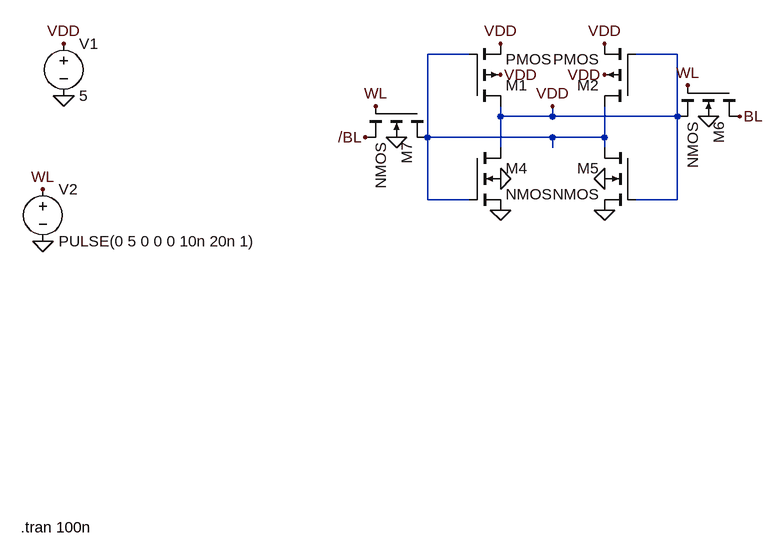
[diagram p0: schematic READ1.asc]
READ1.asc, the LTspice schematic file:
Version 4
SHEET 1 880 856
WIRE 80 112 16 112
WIRE 400 112 336 112
WIRE 128 208 128 192
WIRE 208 208 208 192
WIRE 208 208 128 208
WIRE 400 208 400 112
WIRE 400 208 208 208
WIRE 16 240 16 112
WIRE 208 240 16 240
WIRE 288 240 288 192
WIRE 288 240 208 240
WIRE 128 256 128 208
WIRE 208 256 208 240
WIRE 288 256 288 240
WIRE 16 336 16 240
WIRE 80 336 16 336
WIRE 400 336 400 208
WIRE 400 336 336 336
FLAG -544 96 VDD
FLAG -544 176 0
FLAG 128 144 VDD
FLAG 288 144 VDD
FLAG 128 304 0
FLAG -576 400 0
FLAG -576 320 WL
FLAG 288 304 0
FLAG -32 240 0
FLAG -64 192 WL
FLAG 448 208 0
FLAG 416 160 WL
FLAG -80 240 /BL
FLAG 128 96 VDD
FLAG 288 96 VDD
FLAG 128 352 0
FLAG 288 352 0
FLAG 208 192 VDD
FLAG 496 208 BL
SYMBOL pmos4 80 192 M180
SYMATTR InstName M1
SYMBOL pmos4 336 192 R180
SYMATTR InstName M2
SYMBOL nmos4 16 192 R90
SYMATTR InstName M7
SYMBOL nmos4 80 256 R0
SYMATTR InstName M4
SYMBOL voltage -544 80 R0
SYMATTR InstName V1
SYMATTR Value 5
SYMBOL nmos4 336 256 M0
SYMATTR InstName M5
SYMBOL voltage -576 304 R0
WINDOW 123 0 0 Left 0
WINDOW 39 0 0 Left 0
SYMATTR InstName V2
SYMATTR Value PULSE(0 5 0 0 0 10n 20n 1)
SYMBOL nmos4 496 160 R90
SYMATTR InstName M6
TEXT -610 840 Left 2 !.tran 100n

The netlist it stands for:
* READ1.asc
M1 VDD N001 VDD VDD PMOS
M2 N001 VDD VDD VDD PMOS
M7 N001 WL /BL 0 NMOS
M4 VDD N001 0 0 NMOS
V1 VDD 0 5
M5 N001 VDD 0 0 NMOS
V2 WL 0 PULSE(0 5 0 0 0 10n 20n 1)
M6 BL WL VDD 0 NMOS
.model NMOS NMOS
.model PMOS PMOS
.lib standard.mos
.tran 100n
.backanno
.end